# Altium schematic sheet sensor-3.SchDoc
size Letter
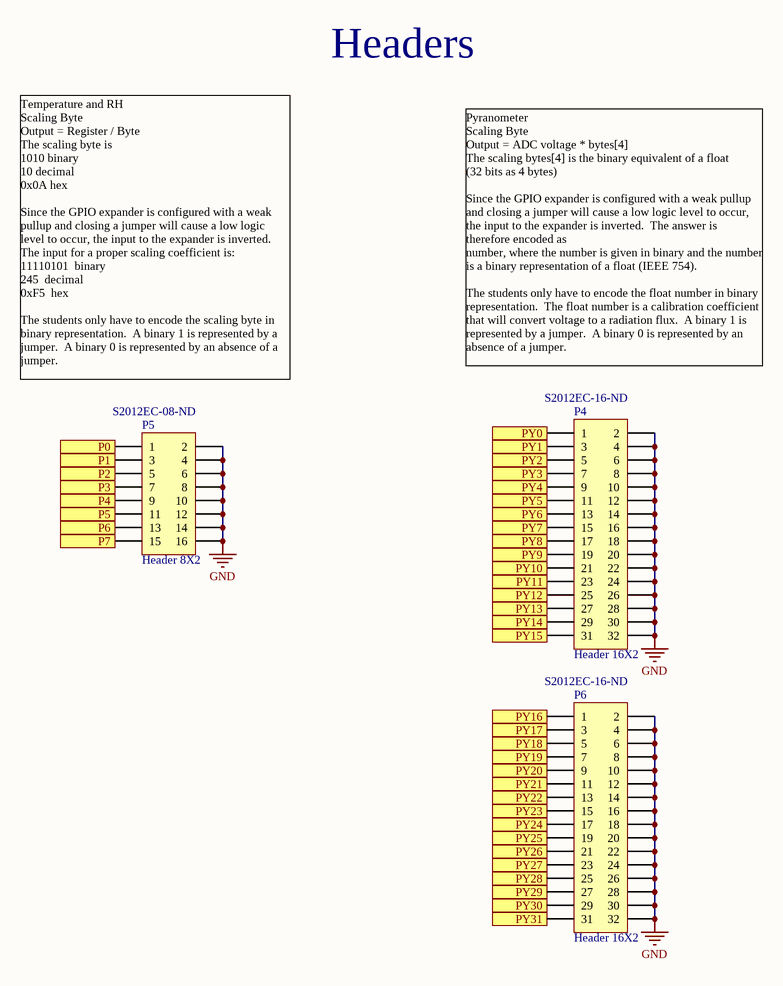
[diagram p0: sensor-3.SchDoc]

## Parts
P4  Header 16X2  Supplier Part Number 1: S2012EC-16-ND  [HDR2X16]
P5  Header 8X2  Supplier Part Number 1: S2012EC-08-ND  [HDR2X8]
P6  Header 16X2  Supplier Part Number 1: S2012EC-16-ND  [HDR2X16]

## Ports
P0, P1, P2, P3, P4, P5, P6, P7, PY0, PY1, PY2, PY3, PY4, PY5, PY6, PY7, PY8, PY9, PY10, PY11, PY12, PY13, PY14, PY15, PY16, PY17, PY18, PY19, PY20, PY21, PY22, PY23, PY24, PY25, PY26, PY27, PY28, PY29, PY30, PY31

## Nets
GND: P4.2 P4.4 P4.6 P4.8 P4.10 P4.12 P4.14 P4.16 P4.18 P4.20 P4.22 P4.24 P4.26 P4.28 P4.30 P4.32 P5.2 P5.4 P5.6 P5.8 P5.10 P5.12 P5.14 P5.16 P6.2 P6.4 P6.6 P6.8 P6.10 P6.12 P6.14 P6.16 P6.18 P6.20 P6.22 P6.24 P6.26 P6.28 P6.30 P6.32
P0: P5.1 ; port P0
P1: P5.3 ; port P1
P2: P5.5 ; port P2
P3: P5.7 ; port P3
P4: P5.9 ; port P4
P5: P5.11 ; port P5
P6: P5.13 ; port P6
P7: P5.15 ; port P7
PY0: P4.1 ; port PY0
PY1: P4.3 ; port PY1
PY2: P4.5 ; port PY2
PY3: P4.7 ; port PY3
PY4: P4.9 ; port PY4
PY5: P4.11 ; port PY5
PY6: P4.13 ; port PY6
PY7: P4.15 ; port PY7
PY8: P4.17 ; port PY8
PY9: P4.19 ; port PY9
PY10: P4.21 ; port PY10
PY11: P4.23 ; port PY11
PY12: P4.25 ; port PY12
PY13: P4.27 ; port PY13
PY14: P4.29 ; port PY14
PY15: P4.31 ; port PY15
PY16: P6.1 ; port PY16
PY17: P6.3 ; port PY17
PY18: P6.5 ; port PY18
PY19: P6.7 ; port PY19
PY20: P6.9 ; port PY20
PY21: P6.11 ; port PY21
PY22: P6.13 ; port PY22
PY23: P6.15 ; port PY23
PY24: P6.17 ; port PY24
PY25: P6.19 ; port PY25
PY26: P6.21 ; port PY26
PY27: P6.23 ; port PY27
PY28: P6.25 ; port PY28
PY29: P6.27 ; port PY29
PY30: P6.29 ; port PY30
PY31: P6.31 ; port PY31

## Notes on the sheet
- Headers
- Pyranometer
  Scaling Byte
  Output = ADC voltage * bytes[4]
  The scaling bytes[4] is the binary equivalent of a float
  (32 bits as 4 bytes)
  Since the GPIO expander is configured with a weak pullup and closing a jumper will cause a low logic level to occur, the input to the expander is inverted.  The answer is therefore encoded as
  number, where the number is given in binary and the number is a binary representation of a float (IEEE 754).
  The students only have to encode the float number in binary representation.  The float number is a calibration coefficient that will convert voltage to a radiation flux.  A binary 1 is represented by a jumper.  A binary 0 is represented by an absence of a jumper.
- Temperature and RH
  Scaling Byte
  Output = Register / Byte
  The scaling byte is
  1010	binary
  10	decimal
  0x0A	hex
  Since the GPIO expander is configured with a weak pullup and closing a jumper will cause a low logic level to occur, the input to the expander is inverted.  The input for a proper scaling coefficient is:
  11110101 	binary
  245 	decimal
  0xF5 	hex
  The students only have to encode the scaling byte in binary representation.  A binary 1 is represented by a jumper.  A binary 0 is represented by an absence of a jumper.

## Library data of the parts
P4 P6 = Header 16X2: Header, 16-Pin, Dual row; Manufacturer: Sullins; Manufacturer Part Number: PREC016DAAN-RC; Number of Positions: 32; Connector Type: Male Pin; Pitch: 0.1inch; LatestRevisionDate: 17-Jul-2002; LatestRevisionNote: Re-released for DXP Platform.; Publisher: Altium Limited; Supplier 1: Digi-Key; Stock 1: 264; Pricing 1: 1=0.61000, 10=0.57200, 25=0.51440, 50=0.45740, 100=0.43830, 250=0.40016, 500=0.38112 (USD); RoHS: Yes; Mount: Through Hole; Color: Black; Contact Plating: Tin; Package Quantity: 1; Number of Rows: 2; Packaging: Bulk; Termination: Solder; Row Spacing: 0.1inch; Contact Mating Length: 0.23inch; ComponentLink1URL: https://datasheet.ciiva.com/740/xrxczzzdxxn-rc-11636-b-740869.pdf?src-supplier=Digi-Key; ComponentLink1Description: https://datasheet.ciiva.com/740/xrxczzzdxxn-rc-11636-b-740869.pdf?src-supplier=Digi-Key
P5 = Header 8X2: Header, 8-Pin, Dual row; Manufacturer: Sullins; Manufacturer Part Number: PREC008DAAN-RC; Number of Positions: 16; Connector Type: Male Pin; Pitch: 0.1inch; LatestRevisionDate: 17-Jul-2002; LatestRevisionNote: Re-released for DXP Platform.; Publisher: Altium Limited; Supplier 1: Digi-Key; Stock 1: 1029; Pricing 1: 1=0.35000, 10=0.33300, 25=0.28600, 50=0.24300, 100=0.23340, 250=0.20960, 500=0.20008 (USD); RoHS: Yes; Mount: Through Hole; Color: Black; Contact Plating: Tin; Package Quantity: 1; Number of Rows: 2; Packaging: Bulk; Termination: Solder; Row Spacing: 0.1inch; Contact Mating Length: 0.23inch; ComponentLink1URL: https://datasheet.ciiva.com/740/xrxczzzdxxn-rc-11636-b-740877.pdf?src-supplier=Digi-Key; ComponentLink1Description: https://datasheet.ciiva.com/740/xrxczzzdxxn-rc-11636-b-740877.pdf?src-supplier=Digi-Key